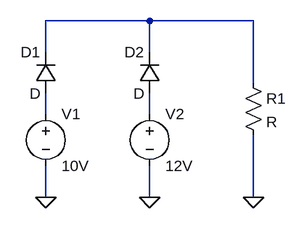
[diagram p0: schematic TP4.asc]
TP4.asc, the LTspice schematic file:
Version 4.1
SHEET 1 880 680
WIRE 272 -16 112 -16
WIRE 432 -16 272 -16
WIRE 112 32 112 -16
WIRE 272 32 272 -16
WIRE 432 80 432 -16
WIRE 112 128 112 96
WIRE 272 128 272 96
WIRE 112 256 112 208
WIRE 272 256 272 208
WIRE 432 256 432 160
FLAG 112 256 0
FLAG 272 256 0
FLAG 432 256 0
SYMBOL voltage 112 112 R0
WINDOW 123 0 0 Left 0
WINDOW 39 0 0 Left 0
SYMATTR InstName V1
SYMATTR Value 10V
SYMBOL voltage 272 112 R0
WINDOW 123 0 0 Left 0
WINDOW 39 0 0 Left 0
SYMATTR InstName V2
SYMATTR Value 12V
SYMBOL diode 128 96 R180
WINDOW 0 24 64 Left 2
WINDOW 3 24 0 Left 2
SYMATTR InstName D1
SYMBOL diode 288 96 R180
WINDOW 0 24 64 Left 2
WINDOW 3 24 0 Left 2
SYMATTR InstName D2
SYMBOL res 416 64 R0
SYMATTR InstName R1

The netlist it stands for:
* TP4.asc
V1 N002 0 10V
V2 N003 0 12V
D1 N002 N001 D
D2 N003 N001 D
R1 N001 0 R
.model D D
.lib standard.dio
.backanno
.end